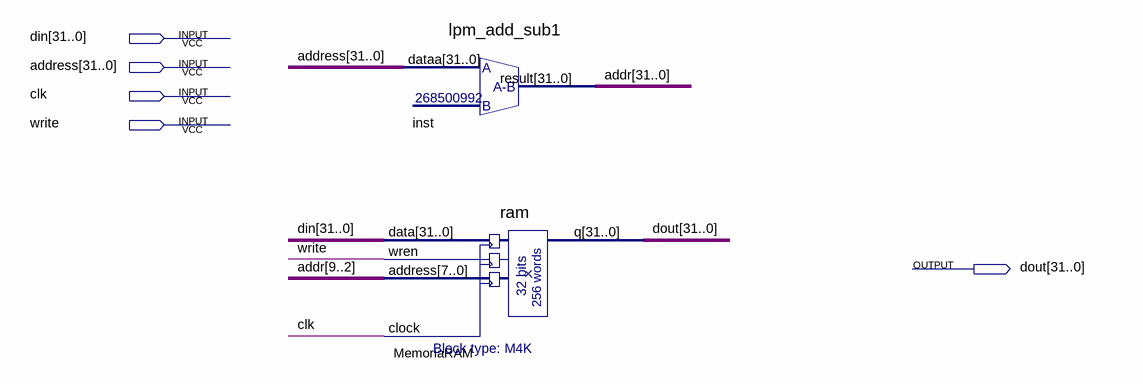
[diagram p0: schematic sheet]
// Quartus schematic data_memory.bdf as structural Verilog: 2 symbols, 5 pins
module data_memory (
  input  [31:0] din,
  input  [31:0] address,
  input  clk,
  input  write,
  output [31:0] dout
);

  wire [31:0] addr;

  ram MemoriaRAM (.data(din), .wren(write), .address(addr[9:2]), .clock(clk), .q(dout));
  lpm_add_sub1 inst (.dataa(address), .result(addr));
endmodule
